# EAGLE schematic Fall Analyzer Circuit (EAGLE 8.6.0)
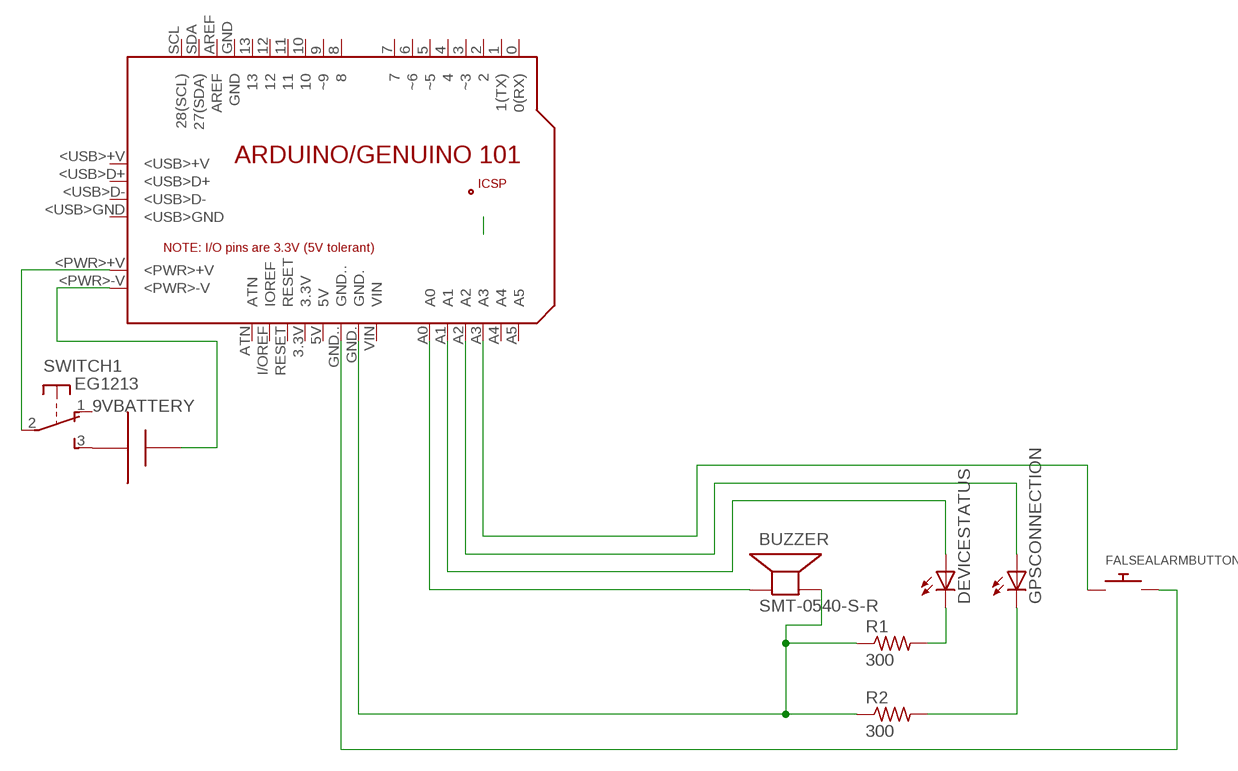
[diagram p0: schematic, sheet 1]

## Parts
9VBATTERY  AAA  [12BH412]
BUZZER  SMT-0540-S-R  [SMT-0540-S-R]
DEVICESTATUS  LED3MM  [LED3MM]
FALSEALARMBUTTON  SWITCH_PUSHBUTTONSOFTTOUCHSMD_SJ  [PUSHBUTTON_SMD_SJ]
GPSCONNECTION  LED3MM  [LED3MM]
PCB1  ARDUINO_101  [ARDUINO_101]
R1  300  R-US_0204/7  [0204/7]
R2  300  R-US_0204/7  [0204/7]
SWITCH  EG1213  [EG1213]

## Nets
N$1: FALSEALARMBUTTON.P$2 PCB1.GND..
N$2: DEVICESTATUS.K(C) R1.2
N$3: GPSCONNECTION.K(C) R2.2
N$4: BUZZER.-(+) PCB1.A0
N$5: DEVICESTATUS.A PCB1.A1
N$6: GPSCONNECTION.A PCB1.A2
N$7: FALSEALARMBUTTON.P$1 PCB1.A3
N$8: PCB1.RESET. PCB1.SCK
N$9: PCB1.<PWR>+V SWITCH.2(1:P)
N$10: BUZZER.+(-) PCB1.GND. R1.1 R2.1
N$11: 9VBATTERY.- SWITCH.3(1:S)
N$12: 9VBATTERY.+ PCB1.<PWR>-V
Unconnected: PCB1.0(0(RX)) PCB1.1(1(TX)) PCB1.2 PCB1.3(~3) PCB1.3.3V PCB1.4 PCB1.5(~5) PCB1.5V PCB1.6(~6) PCB1.7 PCB1.8 PCB1.9(~9) PCB1.10 PCB1.11 PCB1.12 PCB1.13 PCB1.+5V PCB1.<USB>+V PCB1.<USB>D+ PCB1.<USB>D- PCB1.<USB>GND PCB1.A4 PCB1.A5 PCB1.AREF PCB1.ATN PCB1.GND PCB1.GND_ PCB1.I/OREF(IOREF) PCB1.MISO PCB1.MOSI PCB1.RESET PCB1.SCL(28(SCL)) PCB1.SDA(27(SDA)) PCB1.VIN SWITCH.1(1:O) SWITCH.MT1(MT) SWITCH.MT2(MT)

## Library data of the parts
9VBATTERY = adafruit:AAA: AAA PC pin holder Mouser part #12BH412 - but pretty much any 1x AAA battery holder should be the same http://www.ladyada.net/library/pcb/eaglelibrary.html
BUZZER = adafruit:SMT-0540-S-R: SMT-0549-S-R Small surface-mount magnetic buzzer
DEVICESTATUS GPSCONNECTION = adafruit:LED: LED OSRAM: - CHIPLED LG R971, LG N971, LY N971, LG Q971, LY Q971, LO R971, LY R971 LH N974, LH R974 LS Q976, LO Q976, LY Q976 LO Q996 - Hyper CHIPLED LW Q18S LB Q993, LB Q99A, LB R99A - SideLED LS A670, LO A670, LY A670, LG A670, LP A670 LB A673, LV A673, LT A673, LW A673 LH A674 LY A675 LS A676, LA A676, LO A676, LY A676, LW A676 LS A679, LY A679, LG A679 - Hyper Micro SIDELED® LS Y876, LA Y876, LO Y876, LY Y876 LT Y87S - SmartLED LW L88C, LW L88S LB L89C, LB L89S, LG L890 LS L89K, LO L89K, LY L89K LS L896, LA L896, LO L896, LY L896 - TOPLED LS T670, LO T670, LY T670, LG T670, LP T670 LSG T670, LSP T670, LSY T670, LOP T670, LYG T670 LG T671, LOG T671, LSG T671 LB T673, LV T673, LT T673, LW T673 LH T674 LS T676, LA T676, LO T676, LY T676, LB T676, LH T676, LSB T676, LW T676 LB T67C, LV T67C, LT T67C, LS T67K, LO T67K, LY T67K, LW E67C LS E67B, LA E67B, LO E67B, LY E67B, LB E67C, LV E67C, LT E67C LW T67C LS T679, LY T679, LG T679 LS T770, LO T770, LY T770, LG T770, LP T770 LB T773, LV T773, LT T773, LW T773 LH T774 LS E675, LA E675, LY E675, LS T675 LS T776, LA T776, LO T776, LY T776, LB T776 LHGB T686 LT T68C, LB T68C - Hyper Mini TOPLED® LB M676 - Mini TOPLED Santana® LG M470 LS M47K, LO M47K, LY M47K Source: http://www.osram.convergy.de/
FALSEALARMBUTTON = adafruit:SWITCH_PUSHBUTTON: Buttons SOFTTOUCHSMD_SJ - Soft touch temporary push button (Super Junk Akihabara) Compatible with SKPMANE010 [Mouser: 688-SKPMAN] C&K_KSS = Digikey: KSS221GLFS
PCB1 = E14_Arduino_revC:ARDUINO_101: Schematic symbol for representing an Arduino/Genuino 101 board in an EAGLE schematic. Created by Dave Young for Element14. More 101 documentation at: https://www.element14.com/community/docs/DOC-80459/l/intel-genuino-101-development-board More EAGLE documentation at: http://www.element14.com/community/community/knode/cadsoft_eagle
R1 R2 = adafruit:R-US_: RESISTOR, American symbol
SWITCH = adafruit:EG1213: E-Switch right-angle slide SPDT Part #EG1213 http://www.ladyada.net/library/eagle